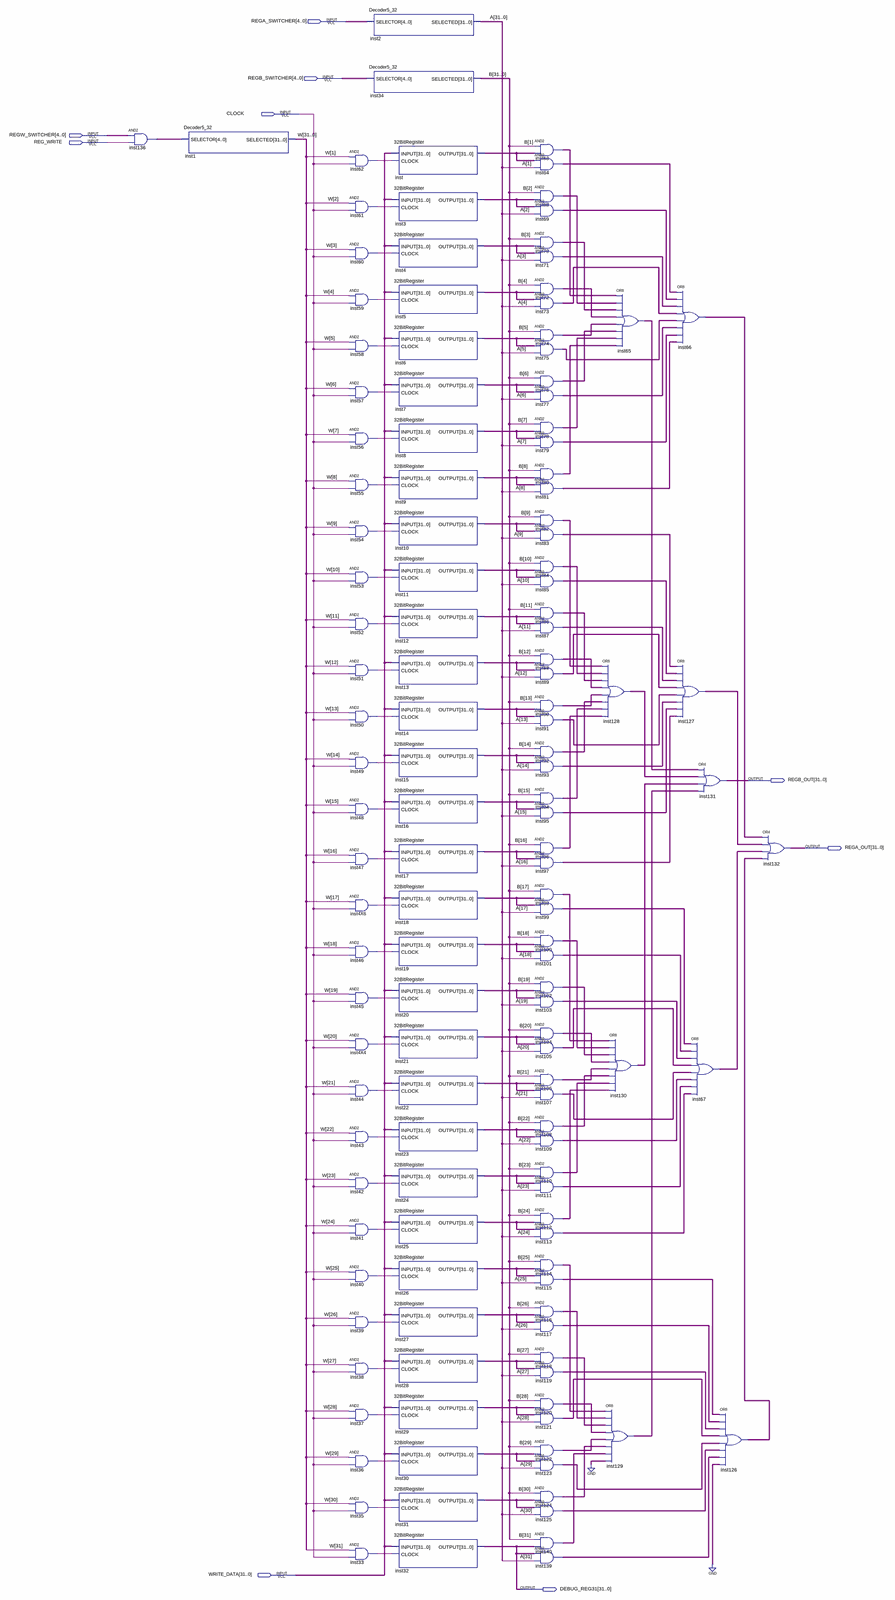
[diagram p0: schematic sheet, whole]
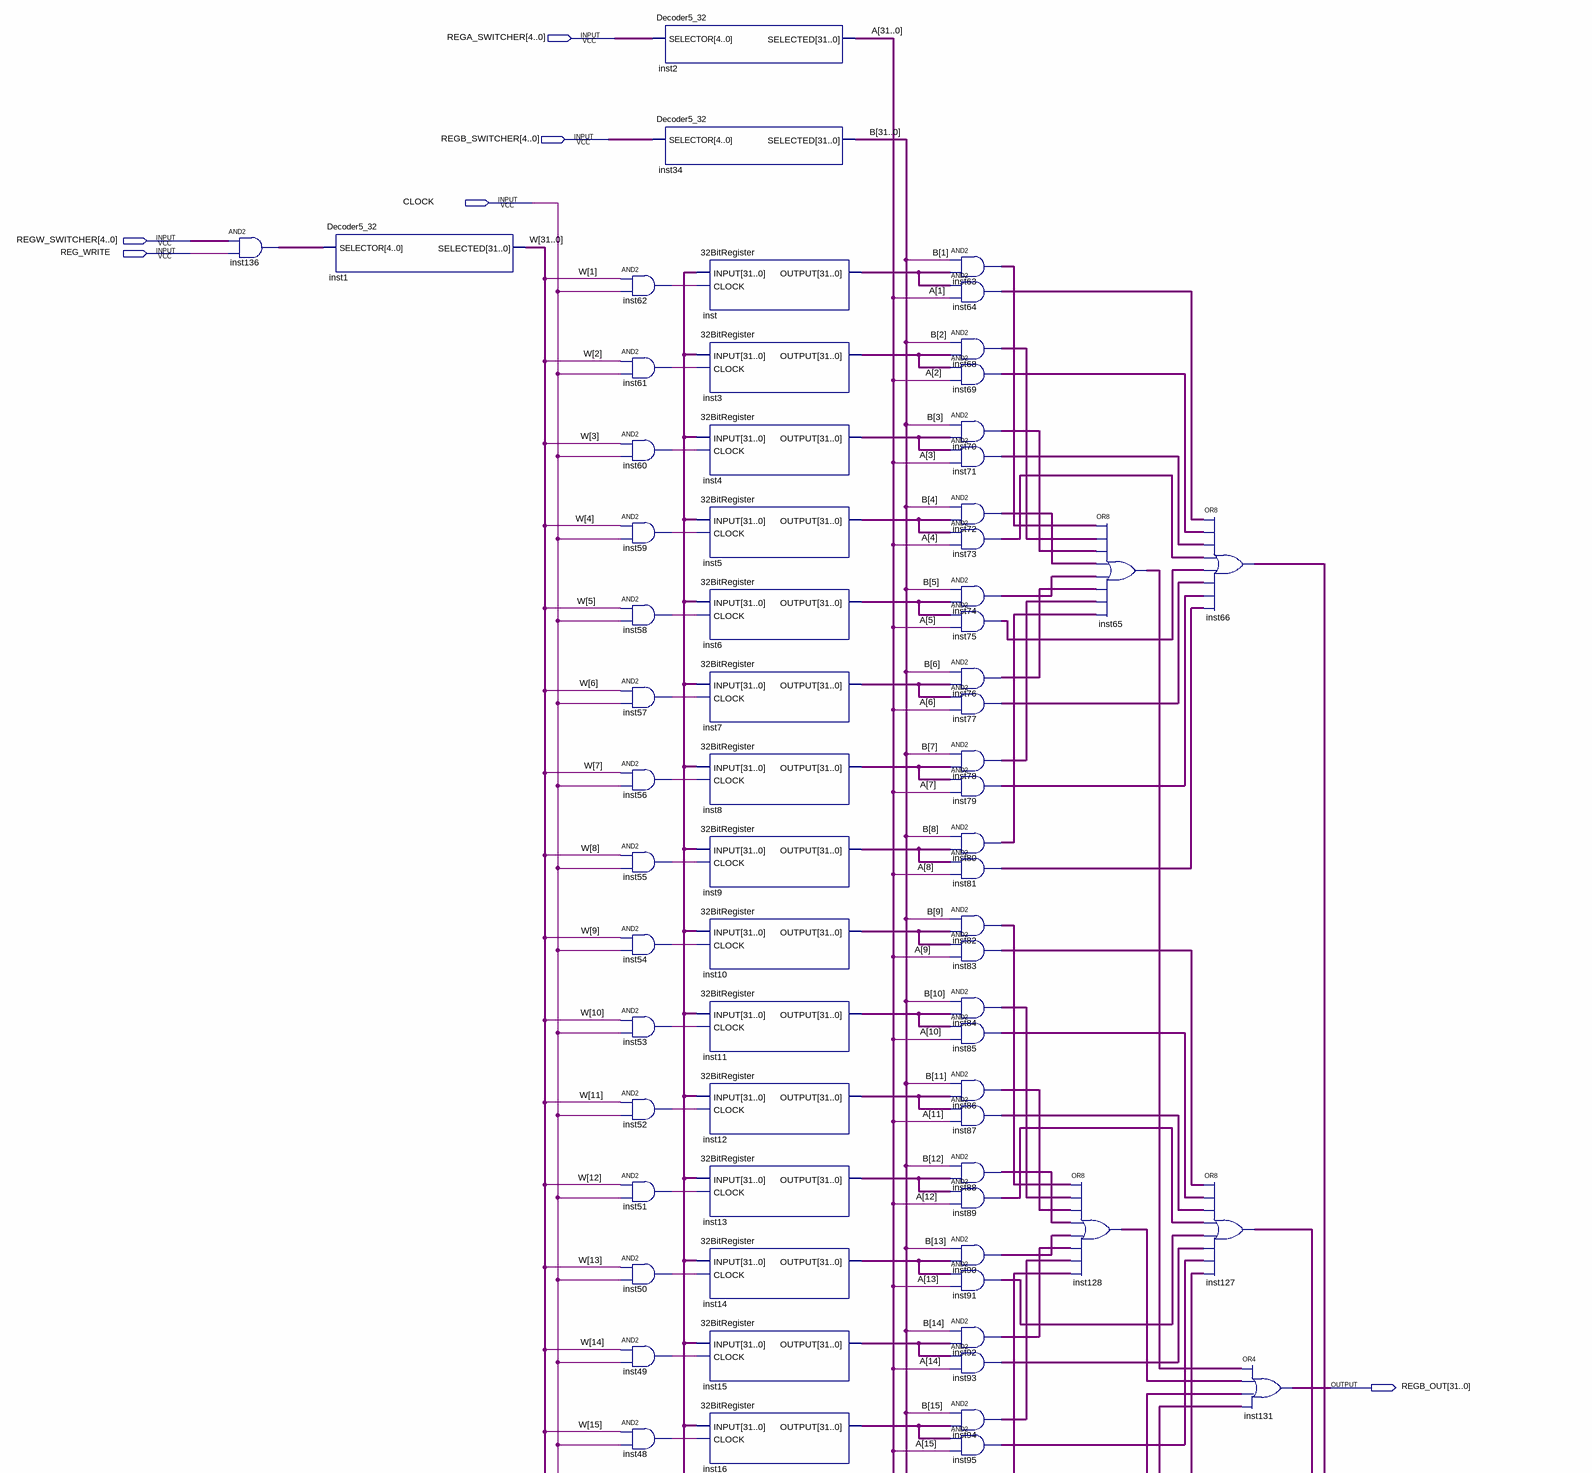
[diagram p1: schematic sheet, upper part]
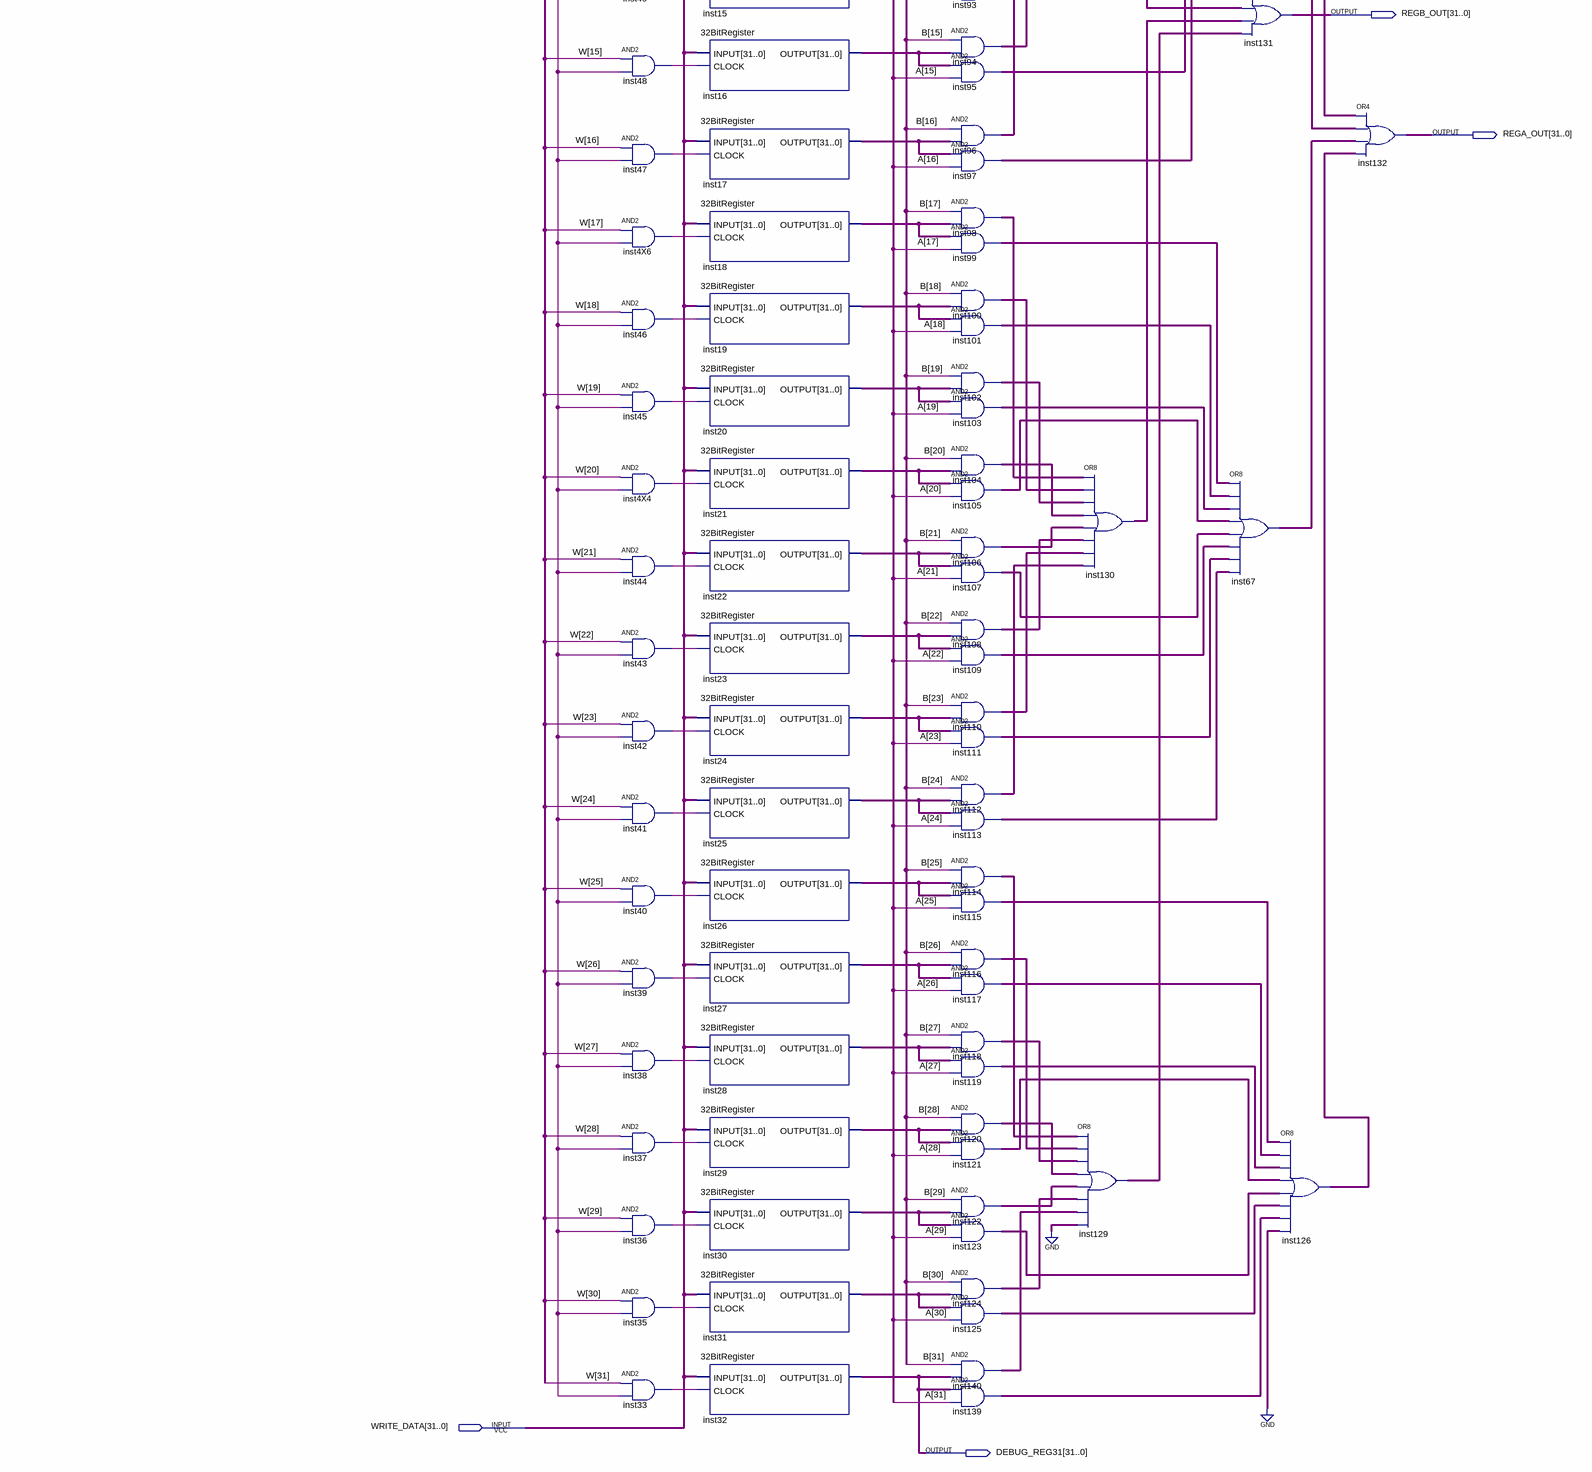
[diagram p2: schematic sheet, lower part]
// Quartus schematic RegisterSequence.bdf as structural Verilog: 138 symbols, 9 pins
module RegisterSequence (
  input  [4:0] REGA_SWITCHER,
  input  [4:0] REGB_SWITCHER,
  input  CLOCK,
  input  [4:0] REGW_SWITCHER,
  input  REG_WRITE,
  input  [31:0] WRITE_DATA,
  output [31:0] REGB_OUT,
  output [31:0] REGA_OUT,
  output [31:0] DEBUG_REG31
);

  wire inst4X4_out, inst4X6_out, inst33_out, inst35_out, inst36_out, inst37_out, inst38_out, inst39_out,
       inst40_out, inst41_out, inst42_out, inst43_out, inst44_out, inst45_out, inst46_out, inst47_out,
       inst48_out, inst49_out, inst50_out, inst51_out, inst52_out, inst53_out, inst54_out, inst55_out,
       inst56_out, inst57_out, inst58_out, inst59_out, inst60_out, inst61_out, inst62_out;
  wire [4:0] inst136_out;
  wire [31:0] A, B, inst3_output, inst4_output, inst5_output, inst6_output, inst7_output, inst8_output,
       inst9_output, inst10_output, inst11_output, inst12_output, inst13_output, inst14_output,
       inst15_output, inst16_output, inst17_output, inst18_output, inst19_output, inst20_output,
       inst21_output, inst22_output, inst23_output, inst24_output, inst25_output, inst26_output,
       inst27_output, inst28_output, inst29_output, inst30_output, inst31_output, inst63_out, inst64_out,
       inst65_out, inst66_out, inst67_out, inst68_out, inst69_out, inst70_out, inst71_out, inst72_out,
       inst73_out, inst74_out, inst75_out, inst76_out, inst77_out, inst78_out, inst79_out, inst80_out,
       inst81_out, inst82_out, inst83_out, inst84_out, inst85_out, inst86_out, inst87_out, inst88_out,
       inst89_out, inst90_out, inst91_out, inst92_out, inst93_out, inst94_out, inst95_out, inst96_out,
       inst97_out, inst98_out, inst99_out, inst100_out, inst101_out, inst102_out, inst103_out, inst104_out,
       inst105_out, inst106_out, inst107_out, inst108_out, inst109_out, inst110_out, inst111_out,
       inst112_out, inst113_out, inst114_out, inst115_out, inst116_out, inst117_out, inst118_out,
       inst119_out, inst120_out, inst121_out, inst122_out, inst123_out, inst124_out, inst125_out,
       inst126_out, inst127_out, inst128_out, inst129_out, inst130_out, inst139_out, inst140_out,
       inst_output, W;

  assign inst136_out = REGW_SWITCHER & {5{REG_WRITE}};  // AND2 inst136, 5 bits wide
  Decoder5_32 inst1 (.SELECTOR(inst136_out), .SELECTED(W));
  and inst62 (inst62_out, W[1], CLOCK);
  and inst61 (inst61_out, W[2], CLOCK);
  and inst60 (inst60_out, W[3], CLOCK);
  and inst59 (inst59_out, W[4], CLOCK);
  and inst58 (inst58_out, W[5], CLOCK);
  and inst57 (inst57_out, W[6], CLOCK);
  and inst56 (inst56_out, W[7], CLOCK);
  and inst55 (inst55_out, W[8], CLOCK);
  and inst54 (inst54_out, W[9], CLOCK);
  and inst53 (inst53_out, W[10], CLOCK);
  and inst52 (inst52_out, W[11], CLOCK);
  and inst51 (inst51_out, W[12], CLOCK);
  and inst50 (inst50_out, W[13], CLOCK);
  and inst49 (inst49_out, W[14], CLOCK);
  and inst48 (inst48_out, W[15], CLOCK);
  and inst47 (inst47_out, W[16], CLOCK);
  and inst4X6 (inst4X6_out, W[17], CLOCK);
  and inst46 (inst46_out, W[18], CLOCK);
  and inst45 (inst45_out, W[19], CLOCK);
  and inst4X4 (inst4X4_out, W[20], CLOCK);
  and inst44 (inst44_out, W[21], CLOCK);
  and inst43 (inst43_out, W[22], CLOCK);
  and inst42 (inst42_out, W[23], CLOCK);
  and inst41 (inst41_out, W[24], CLOCK);
  and inst40 (inst40_out, W[25], CLOCK);
  and inst39 (inst39_out, W[26], CLOCK);
  and inst38 (inst38_out, W[27], CLOCK);
  and inst37 (inst37_out, W[28], CLOCK);
  and inst36 (inst36_out, W[29], CLOCK);
  and inst35 (inst35_out, W[30], CLOCK);
  and inst33 (inst33_out, W[31], CLOCK);
  Decoder5_32 inst2 (.SELECTOR(REGA_SWITCHER), .SELECTED(A));
  Decoder5_32 inst34 (.SELECTOR(REGB_SWITCHER), .SELECTED(B));
  \32BitRegister  inst (.INPUT(WRITE_DATA), .CLOCK(inst62_out), .OUTPUT(inst_output));
  \32BitRegister  inst3 (.INPUT(WRITE_DATA), .CLOCK(inst61_out), .OUTPUT(inst3_output));
  \32BitRegister  inst4 (.INPUT(WRITE_DATA), .CLOCK(inst60_out), .OUTPUT(inst4_output));
  \32BitRegister  inst5 (.INPUT(WRITE_DATA), .CLOCK(inst59_out), .OUTPUT(inst5_output));
  \32BitRegister  inst6 (.INPUT(WRITE_DATA), .CLOCK(inst58_out), .OUTPUT(inst6_output));
  \32BitRegister  inst7 (.INPUT(WRITE_DATA), .CLOCK(inst57_out), .OUTPUT(inst7_output));
  \32BitRegister  inst8 (.INPUT(WRITE_DATA), .CLOCK(inst56_out), .OUTPUT(inst8_output));
  \32BitRegister  inst9 (.INPUT(WRITE_DATA), .CLOCK(inst55_out), .OUTPUT(inst9_output));
  \32BitRegister  inst10 (.INPUT(WRITE_DATA), .CLOCK(inst54_out), .OUTPUT(inst10_output));
  \32BitRegister  inst11 (.INPUT(WRITE_DATA), .CLOCK(inst53_out), .OUTPUT(inst11_output));
  \32BitRegister  inst12 (.INPUT(WRITE_DATA), .CLOCK(inst52_out), .OUTPUT(inst12_output));
  \32BitRegister  inst13 (.INPUT(WRITE_DATA), .CLOCK(inst51_out), .OUTPUT(inst13_output));
  \32BitRegister  inst14 (.INPUT(WRITE_DATA), .CLOCK(inst50_out), .OUTPUT(inst14_output));
  \32BitRegister  inst15 (.INPUT(WRITE_DATA), .CLOCK(inst49_out), .OUTPUT(inst15_output));
  \32BitRegister  inst16 (.INPUT(WRITE_DATA), .CLOCK(inst48_out), .OUTPUT(inst16_output));
  \32BitRegister  inst17 (.INPUT(WRITE_DATA), .CLOCK(inst47_out), .OUTPUT(inst17_output));
  \32BitRegister  inst18 (.INPUT(WRITE_DATA), .CLOCK(inst4X6_out), .OUTPUT(inst18_output));
  \32BitRegister  inst19 (.INPUT(WRITE_DATA), .CLOCK(inst46_out), .OUTPUT(inst19_output));
  \32BitRegister  inst20 (.INPUT(WRITE_DATA), .CLOCK(inst45_out), .OUTPUT(inst20_output));
  \32BitRegister  inst21 (.INPUT(WRITE_DATA), .CLOCK(inst4X4_out), .OUTPUT(inst21_output));
  \32BitRegister  inst22 (.INPUT(WRITE_DATA), .CLOCK(inst44_out), .OUTPUT(inst22_output));
  \32BitRegister  inst23 (.INPUT(WRITE_DATA), .CLOCK(inst43_out), .OUTPUT(inst23_output));
  \32BitRegister  inst24 (.INPUT(WRITE_DATA), .CLOCK(inst42_out), .OUTPUT(inst24_output));
  \32BitRegister  inst25 (.INPUT(WRITE_DATA), .CLOCK(inst41_out), .OUTPUT(inst25_output));
  \32BitRegister  inst26 (.INPUT(WRITE_DATA), .CLOCK(inst40_out), .OUTPUT(inst26_output));
  \32BitRegister  inst27 (.INPUT(WRITE_DATA), .CLOCK(inst39_out), .OUTPUT(inst27_output));
  \32BitRegister  inst28 (.INPUT(WRITE_DATA), .CLOCK(inst38_out), .OUTPUT(inst28_output));
  \32BitRegister  inst29 (.INPUT(WRITE_DATA), .CLOCK(inst37_out), .OUTPUT(inst29_output));
  \32BitRegister  inst30 (.INPUT(WRITE_DATA), .CLOCK(inst36_out), .OUTPUT(inst30_output));
  \32BitRegister  inst31 (.INPUT(WRITE_DATA), .CLOCK(inst35_out), .OUTPUT(inst31_output));
  \32BitRegister  inst32 (.INPUT(WRITE_DATA), .CLOCK(inst33_out), .OUTPUT(DEBUG_REG31));
  assign inst63_out = {32{B[1]}} & inst_output;  // AND2 inst63, 32 bits wide
  assign inst64_out = inst_output & {32{A[1]}};  // AND2 inst64, 32 bits wide
  assign inst68_out = {32{B[2]}} & inst3_output;  // AND2 inst68, 32 bits wide
  assign inst69_out = inst3_output & {32{A[2]}};  // AND2 inst69, 32 bits wide
  assign inst70_out = {32{B[3]}} & inst4_output;  // AND2 inst70, 32 bits wide
  assign inst71_out = inst4_output & {32{A[3]}};  // AND2 inst71, 32 bits wide
  assign inst72_out = {32{B[4]}} & inst5_output;  // AND2 inst72, 32 bits wide
  assign inst73_out = inst5_output & {32{A[4]}};  // AND2 inst73, 32 bits wide
  assign inst74_out = {32{B[5]}} & inst6_output;  // AND2 inst74, 32 bits wide
  assign inst75_out = inst6_output & {32{A[5]}};  // AND2 inst75, 32 bits wide
  assign inst76_out = {32{B[6]}} & inst7_output;  // AND2 inst76, 32 bits wide
  assign inst77_out = inst7_output & {32{A[6]}};  // AND2 inst77, 32 bits wide
  assign inst78_out = {32{B[7]}} & inst8_output;  // AND2 inst78, 32 bits wide
  assign inst79_out = inst8_output & {32{A[7]}};  // AND2 inst79, 32 bits wide
  assign inst80_out = {32{B[8]}} & inst9_output;  // AND2 inst80, 32 bits wide
  assign inst81_out = inst9_output & {32{A[8]}};  // AND2 inst81, 32 bits wide
  assign inst82_out = {32{B[9]}} & inst10_output;  // AND2 inst82, 32 bits wide
  assign inst83_out = inst10_output & {32{A[9]}};  // AND2 inst83, 32 bits wide
  assign inst84_out = {32{B[10]}} & inst11_output;  // AND2 inst84, 32 bits wide
  assign inst85_out = inst11_output & {32{A[10]}};  // AND2 inst85, 32 bits wide
  assign inst86_out = {32{B[11]}} & inst12_output;  // AND2 inst86, 32 bits wide
  assign inst87_out = inst12_output & {32{A[11]}};  // AND2 inst87, 32 bits wide
  assign inst88_out = {32{B[12]}} & inst13_output;  // AND2 inst88, 32 bits wide
  assign inst89_out = inst13_output & {32{A[12]}};  // AND2 inst89, 32 bits wide
  assign inst90_out = {32{B[13]}} & inst14_output;  // AND2 inst90, 32 bits wide
  assign inst91_out = inst14_output & {32{A[13]}};  // AND2 inst91, 32 bits wide
  assign inst92_out = {32{B[14]}} & inst15_output;  // AND2 inst92, 32 bits wide
  assign inst93_out = inst15_output & {32{A[14]}};  // AND2 inst93, 32 bits wide
  assign inst94_out = {32{B[15]}} & inst16_output;  // AND2 inst94, 32 bits wide
  assign inst95_out = inst16_output & {32{A[15]}};  // AND2 inst95, 32 bits wide
  assign inst96_out = {32{B[16]}} & inst17_output;  // AND2 inst96, 32 bits wide
  assign inst97_out = inst17_output & {32{A[16]}};  // AND2 inst97, 32 bits wide
  assign inst98_out = {32{B[17]}} & inst18_output;  // AND2 inst98, 32 bits wide
  assign inst99_out = inst18_output & {32{A[17]}};  // AND2 inst99, 32 bits wide
  assign inst100_out = {32{B[18]}} & inst19_output;  // AND2 inst100, 32 bits wide
  assign inst101_out = inst19_output & {32{A[18]}};  // AND2 inst101, 32 bits wide
  assign inst102_out = {32{B[19]}} & inst20_output;  // AND2 inst102, 32 bits wide
  assign inst103_out = inst20_output & {32{A[19]}};  // AND2 inst103, 32 bits wide
  assign inst104_out = {32{B[20]}} & inst21_output;  // AND2 inst104, 32 bits wide
  assign inst105_out = inst21_output & {32{A[20]}};  // AND2 inst105, 32 bits wide
  assign inst106_out = {32{B[21]}} & inst22_output;  // AND2 inst106, 32 bits wide
  assign inst107_out = inst22_output & {32{A[21]}};  // AND2 inst107, 32 bits wide
  assign inst108_out = {32{B[22]}} & inst23_output;  // AND2 inst108, 32 bits wide
  assign inst109_out = inst23_output & {32{A[22]}};  // AND2 inst109, 32 bits wide
  assign inst110_out = {32{B[23]}} & inst24_output;  // AND2 inst110, 32 bits wide
  assign inst111_out = inst24_output & {32{A[23]}};  // AND2 inst111, 32 bits wide
  assign inst112_out = {32{B[24]}} & inst25_output;  // AND2 inst112, 32 bits wide
  assign inst113_out = inst25_output & {32{A[24]}};  // AND2 inst113, 32 bits wide
  assign inst114_out = {32{B[25]}} & inst26_output;  // AND2 inst114, 32 bits wide
  assign inst115_out = inst26_output & {32{A[25]}};  // AND2 inst115, 32 bits wide
  assign inst116_out = {32{B[26]}} & inst27_output;  // AND2 inst116, 32 bits wide
  assign inst117_out = inst27_output & {32{A[26]}};  // AND2 inst117, 32 bits wide
  assign inst118_out = {32{B[27]}} & inst28_output;  // AND2 inst118, 32 bits wide
  assign inst119_out = inst28_output & {32{A[27]}};  // AND2 inst119, 32 bits wide
  assign inst120_out = {32{B[28]}} & inst29_output;  // AND2 inst120, 32 bits wide
  assign inst121_out = inst29_output & {32{A[28]}};  // AND2 inst121, 32 bits wide
  assign inst122_out = {32{B[29]}} & inst30_output;  // AND2 inst122, 32 bits wide
  assign inst123_out = inst30_output & {32{A[29]}};  // AND2 inst123, 32 bits wide
  assign inst124_out = {32{B[30]}} & inst31_output;  // AND2 inst124, 32 bits wide
  assign inst125_out = inst31_output & {32{A[30]}};  // AND2 inst125, 32 bits wide
  assign inst140_out = {32{B[31]}} & DEBUG_REG31;  // AND2 inst140, 32 bits wide
  assign inst139_out = DEBUG_REG31 & {32{A[31]}};  // AND2 inst139, 32 bits wide
  assign inst128_out = inst82_out | inst84_out | inst86_out | inst88_out | inst90_out | inst92_out | inst94_out | inst96_out;  // OR8 inst128, 32 bits wide
  assign inst130_out = inst98_out | inst100_out | inst102_out | inst104_out | inst106_out | inst108_out | inst110_out | inst112_out;  // OR8 inst130, 32 bits wide
  assign inst129_out = inst114_out | inst116_out | inst118_out | inst120_out | inst122_out | inst124_out | inst140_out | {32{1'b0}};  // OR8 inst129, 32 bits wide
  assign inst65_out = inst63_out | inst68_out | inst70_out | inst72_out | inst74_out | inst76_out | inst78_out | inst80_out;  // OR8 inst65, 32 bits wide
  assign inst66_out = inst64_out | inst69_out | inst71_out | inst73_out | inst75_out | inst77_out | inst79_out | inst81_out;  // OR8 inst66, 32 bits wide
  assign inst127_out = inst83_out | inst85_out | inst87_out | inst89_out | inst91_out | inst93_out | inst95_out | inst97_out;  // OR8 inst127, 32 bits wide
  assign inst67_out = inst99_out | inst101_out | inst103_out | inst105_out | inst107_out | inst109_out | inst111_out | inst113_out;  // OR8 inst67, 32 bits wide
  assign REGB_OUT = inst65_out | inst128_out | inst130_out | inst129_out;  // OR4 inst131, 32 bits wide
  assign inst126_out = inst115_out | inst117_out | inst119_out | inst121_out | inst123_out | inst125_out | inst139_out | {32{1'b0}};  // OR8 inst126, 32 bits wide
  assign REGA_OUT = inst66_out | inst127_out | inst67_out | inst126_out;  // OR4 inst132, 32 bits wide
endmodule
